# Altium schematic sheet top.SchDoc
size A
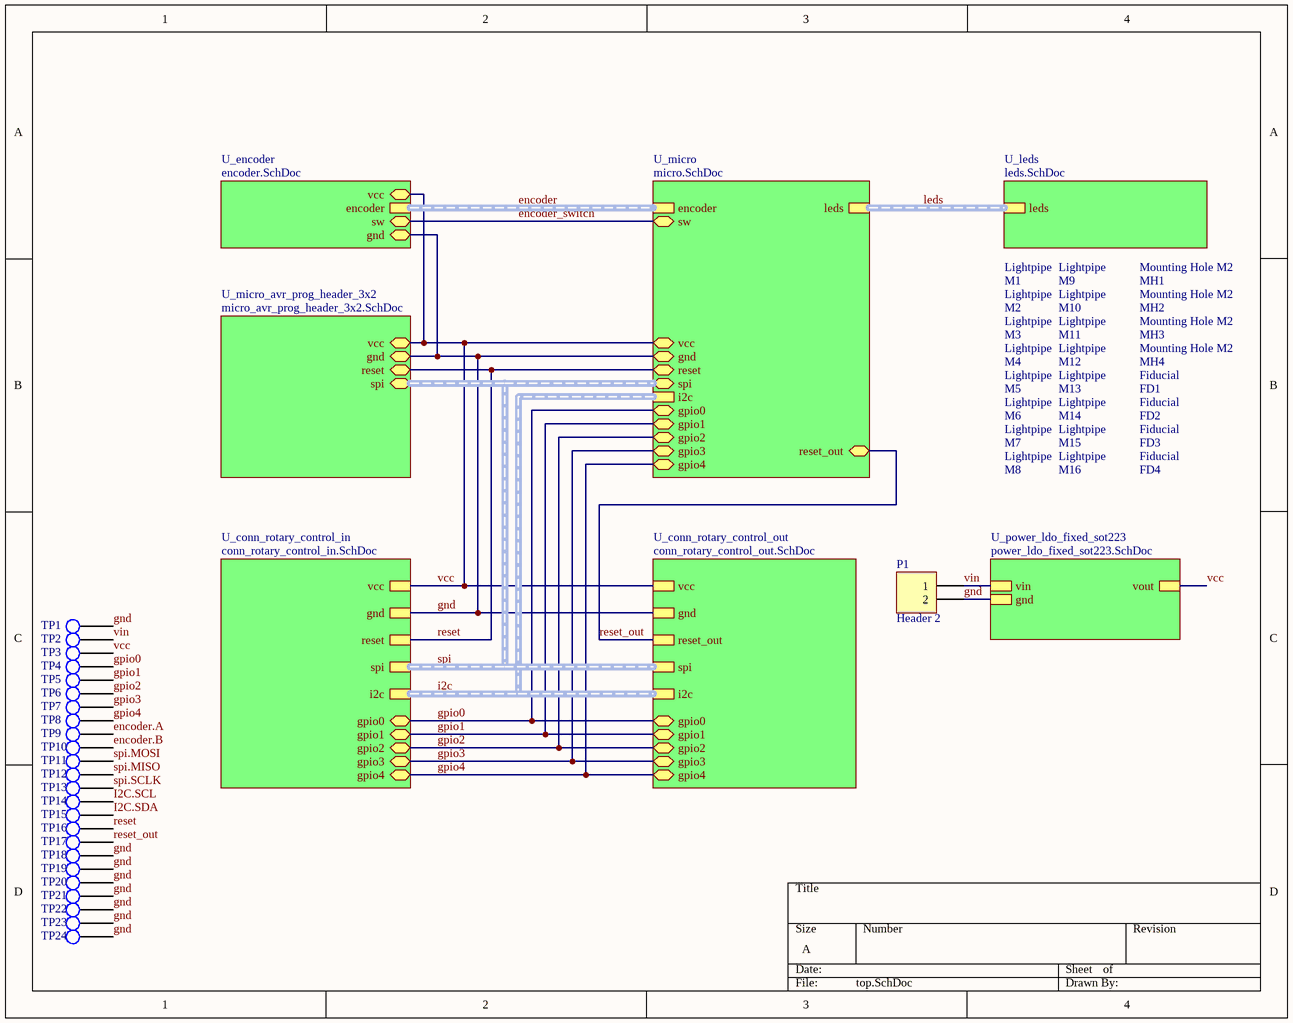
[diagram p0: top.SchDoc]

## Parts
FD1  Component_1  [PCBComponent_1]  (value not drawn)
FD2  Component_1  [PCBComponent_1]  (value not drawn)
FD3  Component_1  [PCBComponent_1]  (value not drawn)
FD4  Component_1  [PCBComponent_1]  (value not drawn)
M1  Component_1  [PCBComponent_1]  (value not drawn)
M2  Component_1  [PCBComponent_1]  (value not drawn)
M3  Component_1  [PCBComponent_1]  (value not drawn)
M4  Component_1  [PCBComponent_1]  (value not drawn)
M5  Component_1  [PCBComponent_1]  (value not drawn)
M6  Component_1  [PCBComponent_1]  (value not drawn)
M7  Component_1  [PCBComponent_1]  (value not drawn)
M8  Component_1  [PCBComponent_1]  (value not drawn)
M9  Component_1  [PCBComponent_1]  (value not drawn)
M10  Component_1  [PCBComponent_1]  (value not drawn)
M11  Component_1  [PCBComponent_1]  (value not drawn)
M12  Component_1  [PCBComponent_1]  (value not drawn)
M13  Component_1  [PCBComponent_1]  (value not drawn)
M14  Component_1  [PCBComponent_1]  (value not drawn)
M15  Component_1  [PCBComponent_1]  (value not drawn)
M16  Component_1  [PCBComponent_1]  (value not drawn)
MH1  Component_1  [PCBComponent_1]  (value not drawn)
MH2  Component_1  [PCBComponent_1]  (value not drawn)
MH3  Component_1  [PCBComponent_1]  (value not drawn)
MH4  Component_1  [PCBComponent_1]  (value not drawn)
P1  Header 2  [HDR1X2]
TP1  Component_1  [PCBComponent_1]  (value not drawn)
TP2  Component_1  [PCBComponent_1]  (value not drawn)
TP3  Component_1  [PCBComponent_1]  (value not drawn)
TP4  Component_1  [PCBComponent_1]  (value not drawn)
TP5  Component_1  [PCBComponent_1]  (value not drawn)
TP6  Component_1  [PCBComponent_1]  (value not drawn)
TP7  Component_1  [PCBComponent_1]  (value not drawn)
TP8  Component_1  [PCBComponent_1]  (value not drawn)
TP9  Component_1  [PCBComponent_1]  (value not drawn)
TP10  Component_1  [PCBComponent_1]  (value not drawn)
TP11  Component_1  [PCBComponent_1]  (value not drawn)
TP12  Component_1  [PCBComponent_1]  (value not drawn)
TP13  Component_1  [PCBComponent_1]  (value not drawn)
TP14  Component_1  [PCBComponent_1]  (value not drawn)
TP15  Component_1  [PCBComponent_1]  (value not drawn)
TP16  Component_1  [PCBComponent_1]  (value not drawn)
TP17  Component_1  [PCBComponent_1]  (value not drawn)
TP18  Component_1  [PCBComponent_1]  (value not drawn)
TP19  Component_1  [PCBComponent_1]  (value not drawn)
TP20  Component_1  [PCBComponent_1]  (value not drawn)
TP21  Component_1  [PCBComponent_1]  (value not drawn)
TP22  Component_1  [PCBComponent_1]  (value not drawn)
TP23  Component_1  [PCBComponent_1]  (value not drawn)
TP24  Component_1  [PCBComponent_1]  (value not drawn)

## Sub-sheets
U_conn_rotary_control_in = conn_rotary_control_in.SchDoc: vcc, gnd, reset, spi (harness Spi_t), i2c (harness I2c_t), gpio0, gpio1, gpio2, gpio3, gpio4
U_conn_rotary_control_out = conn_rotary_control_out.SchDoc: vcc, gnd, reset_out, spi (harness Spi_t), i2c (harness I2c_t), gpio0, gpio1, gpio2, gpio3, gpio4
U_encoder = encoder.SchDoc: encoder (harness encoder_t), gnd, sw, vcc
U_leds = leds.SchDoc: leds (harness Array_4x4_t)
U_micro = micro.SchDoc: leds (harness Array_4x4_t), encoder (harness Encoder_t), i2c (harness i2c_t), vcc, gnd, reset, spi (harness Spi_t), reset_out, gpio0, gpio1, gpio2, gpio3, gpio4, sw
U_micro_avr_prog_header_3x2 = micro_avr_prog_header_3x2.SchDoc: vcc, reset, gnd, spi (harness Spi_t)
U_power_ldo_fixed_sot223 = power_ldo_fixed_sot223.SchDoc: gnd, vin, vout

## Nets
encoder.A: TP9.1
encoder.B: TP10.1
encoder_switch: sheet U_encoder/sw, sheet U_micro/sw
gnd: P1.2 TP1.1 TP18.1 TP19.1 TP20.1 TP21.1 TP22.1 TP23.1 TP24.1 ; sheet U_encoder/gnd, sheet U_micro/gnd, sheet U_micro_avr_prog_header_3x2/gnd, sheet U_conn_rotary_control_in/gnd, sheet U_conn_rotary_control_out/gnd, sheet U_power_ldo_fixed_sot223/gnd
gpio0: TP4.1 ; sheet U_micro/gpio0, sheet U_conn_rotary_control_in/gpio0, sheet U_conn_rotary_control_out/gpio0
gpio1: TP5.1 ; sheet U_micro/gpio1, sheet U_conn_rotary_control_in/gpio1, sheet U_conn_rotary_control_out/gpio1
gpio2: TP6.1 ; sheet U_micro/gpio2, sheet U_conn_rotary_control_in/gpio2, sheet U_conn_rotary_control_out/gpio2
gpio3: TP7.1 ; sheet U_micro/gpio3, sheet U_conn_rotary_control_in/gpio3, sheet U_conn_rotary_control_out/gpio3
gpio4: TP8.1 ; sheet U_micro/gpio4, sheet U_conn_rotary_control_in/gpio4, sheet U_conn_rotary_control_out/gpio4
I2C.SCL: TP14.1
I2C.SDA: TP15.1
reset: TP16.1 ; sheet U_micro/reset, sheet U_micro_avr_prog_header_3x2/reset, sheet U_conn_rotary_control_in/reset
reset_out: TP17.1 ; sheet U_micro/reset_out, sheet U_conn_rotary_control_out/reset_out
spi.MISO: TP12.1
spi.MOSI: TP11.1
spi.SCLK: TP13.1
vcc: TP3.1 ; sheet U_encoder/vcc, sheet U_micro/vcc, sheet U_micro_avr_prog_header_3x2/vcc, sheet U_conn_rotary_control_in/vcc, sheet U_conn_rotary_control_out/vcc, sheet U_power_ldo_fixed_sot223/vout
vin: P1.1 TP2.1 ; sheet U_power_ldo_fixed_sot223/vin

## Buses and harness runs
harness encoder = sheet U_encoder/encoder = sheet U_micro/encoder
harness i2c = sheet U_conn_rotary_control_in/i2c = sheet U_conn_rotary_control_out/i2c = sheet U_micro/i2c
harness leds = sheet U_leds/leds = sheet U_micro/leds
harness spi = sheet U_conn_rotary_control_in/spi = sheet U_conn_rotary_control_out/spi = sheet U_micro/spi = sheet U_micro_avr_prog_header_3x2/spi

## Notes on the sheet
- (in symbol Component_1) Lightpipe; Mounting Hole M2; Fiducial

## Library data of the parts
M1-M16 = Component_1: Light Pipe Vertical; ManufacturerPartNumber: VLP-350-F; Manufacturer: Bivar
P1 = Header 2: Header, 2-Pin; LatestRevisionDate: 17-Jul-2002; LatestRevisionNote: Re-released for DXP Platform.; Publisher: Altium Limited